# Altium project OpenEepromProgrammer.PrjPcb
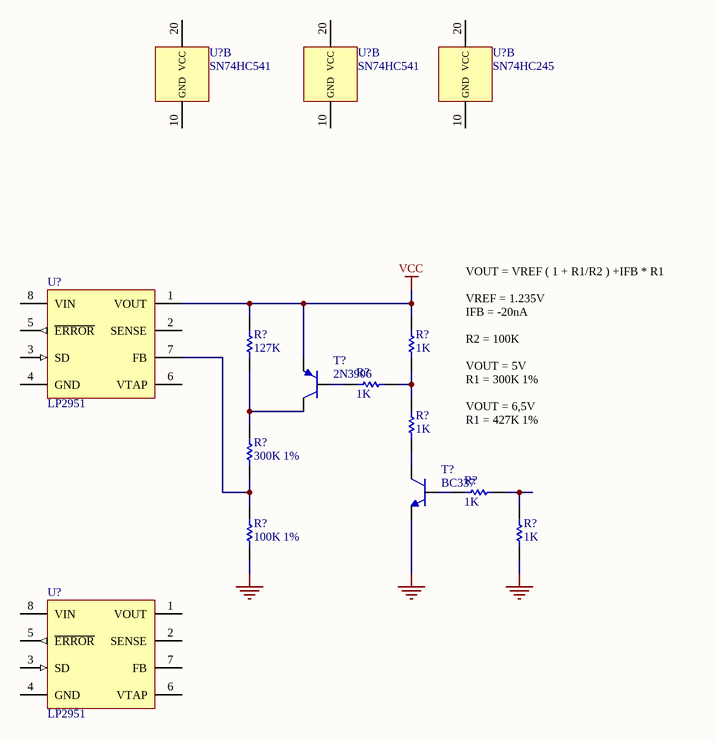
[diagram p0: Power.SchDoc]
3 sheets, 60 parts. Net scope: global (net labels, ports and power ports of the same name join across sheets).
Board file: OpenEepromProgrammer.PcbDoc
Sheets:
  OpenEepromProgrammer.SchDoc
  Power.SchDoc
  Memory.SchDoc

## Sheet OpenEepromProgrammer.SchDoc
size A4

## Sheet Power.SchDoc
size A4

### Parts
(Parts that share a designator on the sheet are numbered #1, #2 ... from top to bottom, then left to right.)
R?#1  127K  [0805]
R?#2  1K  [0805]
R?#3  1K  [0805]
R?#4  1K  [0805]
R?#5  300K 1%  [0805]
R?#6  1K  [0805]
R?#7  100K 1%  [0805]
R?#8  1K  [0805]
T?#1  2N3906  [TO-92 STRAIGHT]
T?#2  BC337  [TO-92 STRAIGHT]
U?#1  SN74HC541  [SOIC20]  (part B of 2)
U?#2  SN74HC541  [SOIC20]  (part B of 2)
U?#3  SN74HC245  [SOIC20]  (part B of 2)
U?#4  LP2951  [SOIC8]
U?#5  LP2951  [SOIC8]

### Nets
GND: R?#7.2 R?#8.2 T?#2.3(E)
VCC: R?#1.1 R?#2.1 T?#1.1(E) U?#4.1(VOUT)
NetR?#1_2: R?#1.2 R?#5.1 T?#1.3(C)
NetR?#2_2: R?#2.2 R?#3.2 R?#4.1
NetR?#3_1: R?#3.1 T?#1.2(B)
NetR?#4_2: R?#4.2 T?#2.1(C)
NetR?#5_2: R?#5.2 R?#7.1 U?#4.7(FB)
NetR?#6_1: R?#6.1 T?#2.2(B)
NetR?#6_2: R?#6.2 R?#8.1

Not connected (* = marked no-connect by the designer): U?#1 10(GND) 20(VCC); U?#2 10(GND) 20(VCC); U?#3 10(GND) 20(VCC); U?#4 2(SENSE) 3(SD) 4(GND) 5(~{ERROR}) 6(VTAP) 8(VIN); U?#5 1(VOUT) 2(SENSE) 3(SD) 4(GND) 5(~{ERROR}) 6(VTAP) 7(FB) 8(VIN)

### Notes on the sheet
- VOUT = VREF ( 1 + R1/R2 ) +IFB * R1
  VREF = 1.235V
  IFB = -20nA
  R2 = 100K
  VOUT = 5V
  R1 = 300K 1%
  VOUT = 6,5V
  R1 = 427K 1%

### Library data of the parts
R?#1-R?#8 = Resistor
T?#1 = 2N3906: PNP Silicon General Purpose Transistors
T?#2 = BC337: NPN Silicon Amplifier Transistors
U?#1 U?#2 = SN74HC541 Type-2: Octal Buffers and Line Drivers With 3-State Outputs
U?#3 = SN74HC245 Type-2: Octal Bus Transceivers with 3-State Outputs
U?#4 U?#5 = LP2951 Type 2: Micropower Voltage Regulators with Shutdown

## Sheet Memory.SchDoc
size A4
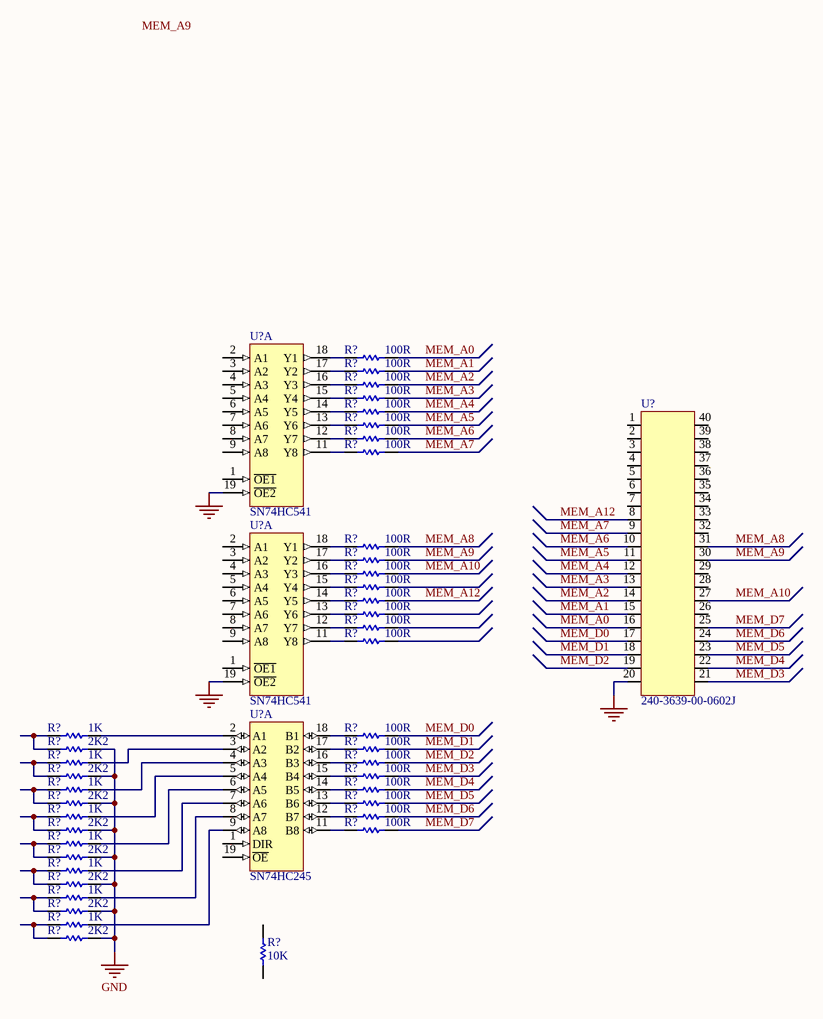
[diagram p1: Memory.SchDoc]

### Parts
(Parts that share a designator on the sheet are numbered #1, #2 ... from top to bottom, then left to right.)
R?#9  100R  [0805]
R?#10  100R  [0805]
R?#11  100R  [0805]
R?#12  100R  [0805]
R?#13  100R  [0805]
R?#14  100R  [0805]
R?#15  100R  [0805]
R?#16  100R  [0805]
R?#17  100R  [0805]
R?#18  100R  [0805]
R?#19  100R  [0805]
R?#20  100R  [0805]
R?#21  100R  [0805]
R?#22  100R  [0805]
R?#23  100R  [0805]
R?#24  100R  [0805]
R?#25  1K  [0805]
R?#26  100R  [0805]
R?#27  2K2  [0805]
R?#28  100R  [0805]
R?#29  1K  [0805]
R?#30  100R  [0805]
R?#31  2K2  [0805]
R?#32  100R  [0805]
R?#33  1K  [0805]
R?#34  100R  [0805]
R?#35  2K2  [0805]
R?#36  100R  [0805]
R?#37  1K  [0805]
R?#38  100R  [0805]
R?#39  2K2  [0805]
R?#40  100R  [0805]
R?#41  1K  [0805]
R?#42  2K2  [0805]
R?#43  1K  [0805]
R?#44  2K2  [0805]
R?#45  1K  [0805]
R?#46  2K2  [0805]
R?#47  1K  [0805]
R?#48  2K2  [0805]
R?#49  10K  [0805]
U?#6  SN74HC541  [SOIC20]  (part A of 2)
U?#7  SN74HC541  [SOIC20]  (part A of 2)
U?#8  240-3639-00-0602J  [240-3639-00-0602J]
U?#9  SN74HC245  [SOIC20]  (part A of 2)

### Nets
GND: R?#27.2 R?#31.2 R?#35.2 R?#39.2 R?#42.2 R?#44.2 R?#46.2 R?#48.2 U?#6.19(~{OE2}) U?#7.19(~{OE2}) U?#8.20
MEM_A0: R?#9.2 U?#8.16
MEM_A1: R?#10.2 U?#8.15
MEM_A2: R?#11.2 U?#8.14
MEM_A3: R?#12.2 U?#8.13
MEM_A4: R?#13.2 U?#8.12
MEM_A5: R?#14.2 U?#8.11
MEM_A6: R?#15.2 U?#8.10
MEM_A7: R?#16.2 U?#8.9
MEM_A8: R?#17.2 U?#8.31
MEM_A9: R?#18.2 U?#8.30
MEM_A10: R?#19.2 U?#8.27
MEM_A12: R?#21.2 U?#8.8
MEM_D0: R?#26.2 U?#8.17
MEM_D1: R?#28.2 U?#8.18
MEM_D2: R?#30.2 U?#8.19
MEM_D3: R?#32.2 U?#8.21
MEM_D4: R?#34.2 U?#8.22
MEM_D5: R?#36.2 U?#8.23
MEM_D6: R?#38.2 U?#8.24
MEM_D7: R?#40.2 U?#8.25
NetR?#9_1: R?#9.1 U?#6.18(Y1)
NetR?#10_1: R?#10.1 U?#6.17(Y2)
NetR?#11_1: R?#11.1 U?#6.16(Y3)
NetR?#12_1: R?#12.1 U?#6.15(Y4)
NetR?#13_1: R?#13.1 U?#6.14(Y5)
NetR?#14_1: R?#14.1 U?#6.13(Y6)
NetR?#15_1: R?#15.1 U?#6.12(Y7)
NetR?#16_1: R?#16.1 U?#6.11(Y8)
NetR?#17_1: R?#17.1 U?#7.18(Y1)
NetR?#18_1: R?#18.1 U?#7.17(Y2)
NetR?#19_1: R?#19.1 U?#7.16(Y3)
NetR?#20_1: R?#20.1 U?#7.15(Y4)
NetR?#21_1: R?#21.1 U?#7.14(Y5)
NetR?#22_1: R?#22.1 U?#7.13(Y6)
NetR?#23_1: R?#23.1 U?#7.12(Y7)
NetR?#24_1: R?#24.1 U?#7.11(Y8)
NetR?#25_1: R?#25.1 R?#27.1
NetR?#25_2: R?#25.2 U?#9.2(A1)
NetR?#26_1: R?#26.1 U?#9.18(B1)
NetR?#28_1: R?#28.1 U?#9.17(B2)
NetR?#29_1: R?#29.1 R?#31.1
NetR?#29_2: R?#29.2 U?#9.3(A2)
NetR?#30_1: R?#30.1 U?#9.16(B3)
NetR?#32_1: R?#32.1 U?#9.15(B4)
NetR?#33_1: R?#33.1 R?#35.1
NetR?#33_2: R?#33.2 U?#9.4(A3)
NetR?#34_1: R?#34.1 U?#9.14(B5)
NetR?#36_1: R?#36.1 U?#9.13(B6)
NetR?#37_1: R?#37.1 R?#39.1
NetR?#37_2: R?#37.2 U?#9.5(A4)
NetR?#38_1: R?#38.1 U?#9.12(B7)
NetR?#40_1: R?#40.1 U?#9.11(B8)
NetR?#41_1: R?#41.1 R?#42.1
NetR?#41_2: R?#41.2 U?#9.6(A5)
NetR?#43_1: R?#43.1 R?#44.1
NetR?#43_2: R?#43.2 U?#9.7(A6)
NetR?#45_1: R?#45.1 R?#46.1
NetR?#45_2: R?#45.2 U?#9.8(A7)
NetR?#47_1: R?#47.1 R?#48.1
NetR?#47_2: R?#47.2 U?#9.9(A8)

Not connected (* = marked no-connect by the designer): R?#20 2; R?#22 2; R?#23 2; R?#24 2; R?#49 1 2; U?#6 1(~{OE1}) 2(A1) 3(A2) 4(A3) 5(A4) 6(A5) 7(A6) 8(A7) 9(A8); U?#7 1(~{OE1}) 2(A1) 3(A2) 4(A3) 5(A4) 6(A5) 7(A6) 8(A7) 9(A8); U?#8 1 2 3 4 5 6 7 26 28 29 32 33 34 35 36 37 38 39 40; U?#9 1(DIR) 19(~{OE})

### Notes on the sheet
- Labels drawn without touching a wire or pin: MEM_A9

### Library data of the parts
R?#9-R?#49 = Resistor
U?#6 U?#7 = SN74HC541 Type-2: as U?#1 on sheet Power
U?#8 = 240-3639-00-0602J: DIP Sockets - 40 Pins
U?#9 = SN74HC245 Type-2: as U?#3 on sheet Power

## Nets that join several sheets
GND: Power (R?#7.2 R?#8.2 T?#2.3), Memory (11 pins)